# EAGLE design BRMDOOR_control_board (EAGLE 7.2.0)
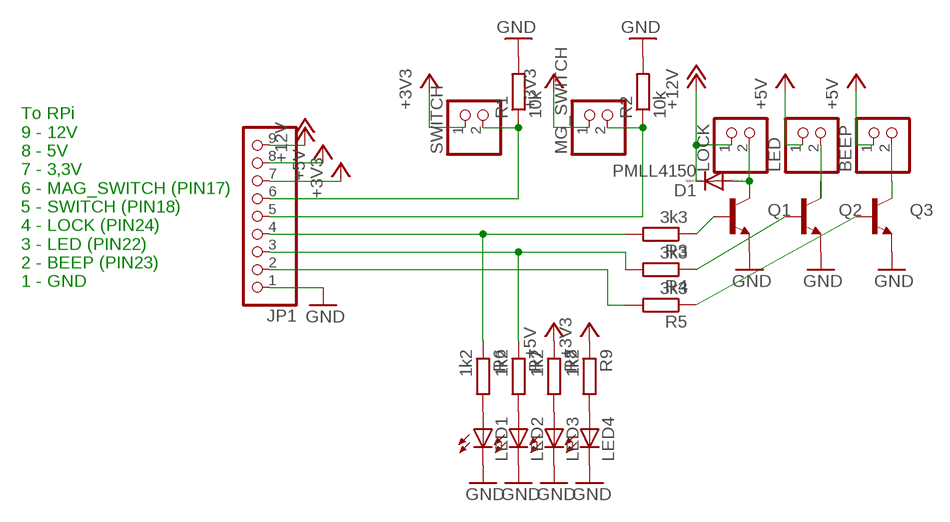
[diagram p0: schematic, sheet 1]

## Parts
BEEP  PINHD-1X2  [1X02]
D1  PMLL4150  [SOD80C]
JP1  PINHD-1X9  [1X09]
LED  PINHD-1X2  [1X02]
LED1  LEDKA-3528ASYC  [KA-3528ASYC]
LED2  LEDKA-3528ASYC  [KA-3528ASYC]
LED3  LEDKA-3528ASYC  [KA-3528ASYC]
LED4  LEDKA-3528ASYC  [KA-3528ASYC]
LOCK  PINHD-1X2  [1X02]
MG_SWITCH  PINHD-1X2  [1X02]
Q1  TRANSISTOR_NPNSMD2  [SOT223]
Q2  TRANSISTOR_NPNSMD2  [SOT223]
Q3  TRANSISTOR_NPNSMD2  [SOT223]
R1  10k  R-EU_M1206  [M1206]
R2  10k  R-EU_M1206  [M1206]
R3  3k3  R-EU_M1206  [M1206]
R4  3k3  R-EU_M1206  [M1206]
R5  3k3  R-EU_M1206  [M1206]
R6  1k2  R-EU_M1206  [M1206]
R7  1k2  R-EU_M1206  [M1206]
R8  1k2  R-EU_M1206  [M1206]
R9  1k2  R-EU_M1206  [M1206]
SWITCH  PINHD-1X2  [1X02]

## Nets
+3V3: JP1.7 MG_SWITCH.1 R9.1 SWITCH.1
+5V: BEEP.1 JP1.8 LED.1 R8.1
+12V: D1.C JP1.9 LOCK.1
GND: JP1.1 LED1.C LED2.C LED3.C LED4.C Q1.3(E) Q2.3(E) Q3.3(E) R1.2 R2.2
N$1: JP1.6 R1.1 SWITCH.2
N$2: JP1.5 MG_SWITCH.2 R2.1
N$3: Q1.1(B) R3.1
N$4: Q2.1(B) R4.1
N$5: Q3.1(B) R5.1
N$6: JP1.4 R3.2 R6.1
N$7: JP1.3 R4.2 R7.1
N$8: JP1.2 R5.2
N$9: LED1.A R6.2
N$10: LED2.A R7.2
N$11: LED3.A R8.2
N$12: LED4.A R9.2
N$13: D1.A LOCK.2 Q1.2(C)
N$14: LED.2 Q2.2(C)
N$15: BEEP.2 Q3.2(C)

## Notes on the sheet
- To RPi
  9 - 12V 
  8 - 5V
  7 - 3,3V
  6 - MAG_SWITCH (PIN17)
  5 - SWITCH (PIN18)
  4 - LOCK (PIN24)
  3 - LED (PIN22)
  2 - BEEP (PIN23)
  1 - GND

## Library data of the parts
BEEP LED LOCK MG_SWITCH SWITCH = pinhead:PINHD-1X2: PIN HEADER
D1 = diode:PMLL4150: DIODE high speed
JP1 = pinhead:PINHD-1X9: PIN HEADER
LED1-LED4 = led:LED: LED OSRAM: - CHIPLED LG R971, LG N971, LY N971, LG Q971, LY Q971, LO R971, LY R971 LH N974, LH R974 LS Q976, LO Q976, LY Q976 LO Q996 - Hyper CHIPLED LW Q18S LB Q993, LB Q99A, LB R99A - SideLED LS A670, LO A670, LY A670, LG A670, LP A670 LB A673, LV A673, LT A673, LW A673 LH A674 LY A675 LS A676, LA A676, LO A676, LY A676, LW A676 LS A679, LY A679, LG A679 - Hyper Micro SIDELED® LS Y876, LA Y876, LO Y876, LY Y876 LT Y87S - SmartLED LW L88C, LW L88S LB L89C, LB L89S, LG L890 LS L89K, LO L89K, LY L89K LS L896, LA L896, LO L896, LY L896 - TOPLED LS T670, LO T670, LY T670, LG T670, LP T670 LSG T670, LSP T670, LSY T670, LOP T670, LYG T670 LG T671, LOG T671, LSG T671 LB T673, LV T673, LT T673, LW T673 LH T674 LS T676, LA T676, LO T676, LY T676, LB T676, LH T676, LSB T676, LW T676 LB T67C, LV T67C, LT T67C, LS T67K, LO T67K, LY T67K, LW E67C LS E67B, LA E67B, LO E67B, LY E67B, LB E67C, LV E67C, LT E67C LW T67C LS T679, LY T679, LG T679 LS T770, LO T770, LY T770, LG T770, LP T770 LB T773, LV T773, LT T773, LW T773 LH T774 LS E675, LA E675, LY E675, LS T675 LS T776, LA T776, LO T776, LY T776, LB T776 LHGB T686 LT T68C, LB T68C - Hyper Mini TOPLED® LB M676 - Mini TOPLED Santana® LG M470 LS M47K, LO M47K, LY M47K Source: http://www.osram.convergy.de LUXEON: - LUMILED® LXK2-PW12-R00, LXK2-PW12-S00, LXK2-PW14-U00, LXK2-PW14-V00 LXK2-PM12-R00, LXK2-PM12-S00, LXK2-PM14-U00 LXK2-PE12-Q00, LXK2-PE12-R00, LXK2-PE12-S00, LXK2-PE14-T00, LXK2-PE14-U00 LXK2-PB12-K00, LXK2-PB12-L00, LXK2-PB12-M00, LXK2-PB14-N00, LXK2-PB14-P00, LXK2-PB14-Q00 LXK2-PR12-L00, LXK2-PR12-M00, LXK2-PR14-Q00, LXK2-PR14-R00 LXK2-PD12-Q00, LXK2-PD12-R00, LXK2-PD12-S00 LXK2-PH12-R00, LXK2-PH12-S00 LXK2-PL12-P00, LXK2-PL12-Q00, LXK2-PL12-R00 Source: www.luxeon.com KINGBRIGHT: KA-3528ASYC Source: www.kingbright.com
Q1-Q3 = SparkFun-DiscreteSemi:TRANSISTOR_NPN: Generic NPN BJT MMBT2222A - TRANS-08049 (SOT-23, 1A 40V) MPSA42 - TRANS-09116 (SOT-23, 500mA 300V) MMBT5088LT1G - TRANS-11160 (SOT-23, 50 mA 30V) BC547 - COM-08928 <http://www.sparkfun.com/products/8928> (TO-92 45V 100mA) (1.Collector 2.Base 3.Emitter) 2N3904 - COM-00521 <http://www.sparkfun.com/products/521> (TO-92 40V 200mA) (1.Emitter 2.Base 3.Collector) P2N2222A - COM-12852 <http://www.sparkfun.com/products/12852> (TO-92 40V 600mA) (1.Collector 2.Base 3.Emitter)
R1-R9 = rcl:R-EU_: RESISTOR, European symbol

## Board
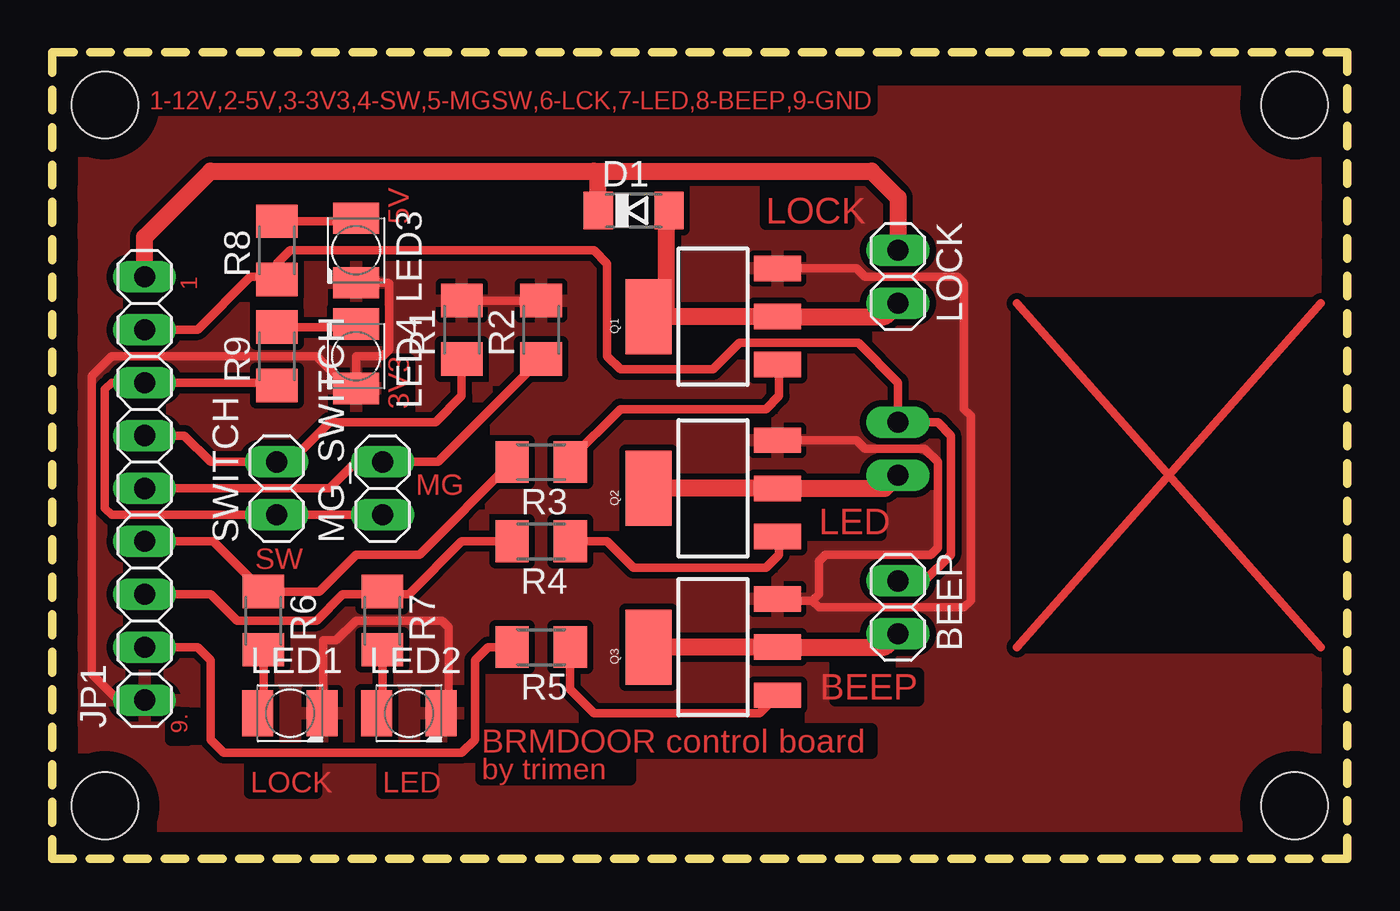
[diagram p1: board, top side]
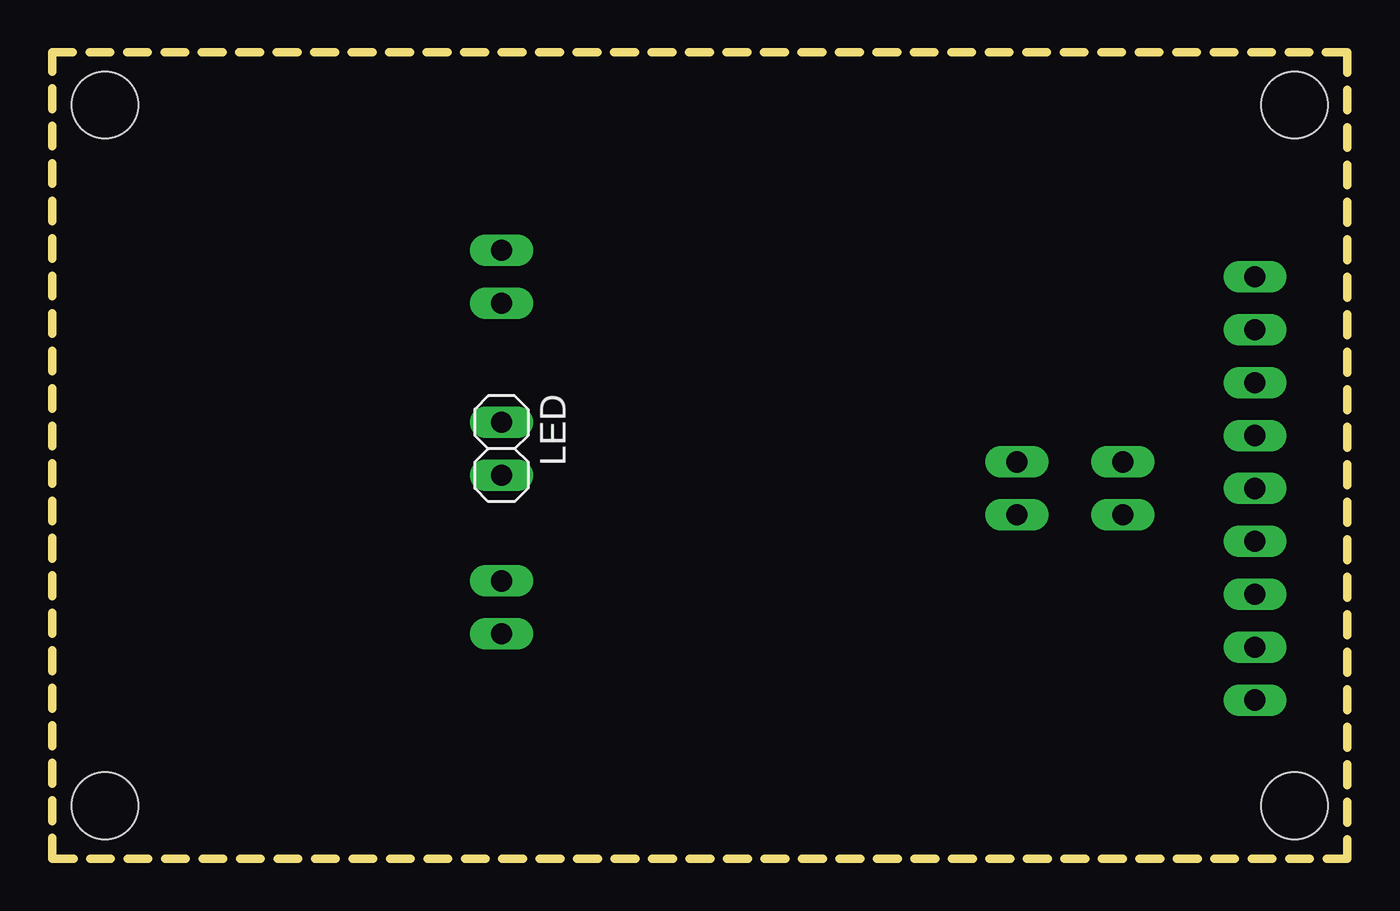
[diagram p2: board, bottom side, seen from below]

Size 62.23 x 38.73 mm. Coordinates in mm from the lower left corner, seen from the top.
Outline: 0,38.73 0,0 62.23,0 62.23,38.73 0,38.73
Copper layers (1*16): Top 0.035mm / dielectric 1.5mm / Bottom 0.035mm
Design rules "default": minimum track width 10mil, minimum drill 24mil, track to track 8mil, track to pad 8mil, pad to pad 8mil, via to via 8mil, smd to smd 8mil, copper to edge 40mil, drill to drill 8mil, minimum pad ring 10mil, minimum via ring 8mil, stop-mask expansion 4mil, vias tented up to drill 0mil, thermal gap 10mil
Holes 3.2 mm at 2.54,36.2 59.69,36.2 59.69,2.54 2.54,2.54
tRestrict: area 46.4,10.2 to 61,26.7

### Footprints (pad centres in the part's own frame; a part is rotated, then mirrored left to right if it is on the bottom)
1X02 = drill 1.016 long: 1 -1.27,0; 2 1.27,0
SOD80C = smd 1.4 x 1.8: A 1.7,0; C -1.7,0
1X09 = drill 1.016 long: 1 -10.16,0; 2 -7.62,0; 3 -5.08,0; 4 -2.54,0; 5 0,0; 6 2.54,0; 7 5.08,0; 8 7.62,0; 9 10.16,0
KA-3528ASYC = smd 1.5 x 2.2: A -1.55,0; C 1.55,0
SOT223 = smd 1.219 x 2.235: 1 -2.311,-3.099; 2 0,-3.099; 3 2.311,-3.099 | smd 3.6 x 2.2: 4 0,3.099
M1206 = smd 1.6 x 2: 1 -1.4,0; 2 1.4,0

### Placement (x,y rotation side)
BEEP  40.64,12.07 270 top
D1  27.94,31.11 0 top
JP1  4.45,17.78 90 top
LED  40.64,19.68 270 bottom
LED1  11.43,6.98 0 top
LED2  17.14,6.98 0 top
LED3  14.61,29.21 270 top
LED4  14.61,24.13 270 top
LOCK  40.64,27.94 270 top
MG_SWITCH  15.88,17.78 90 top
Q1  31.75,26.04 90 top
Q2  31.75,17.78 90 top
Q3  31.75,10.16 90 top
R1  19.68,25.4 90 top
R2  23.5,25.4 90 top
R3  23.5,19.05 180 top
R4  23.5,15.24 180 top
R5  23.5,10.16 180 top
R6  10.16,11.43 270 top
R7  15.88,11.43 270 top
R8  10.79,29.21 90 top
R9  10.79,24.13 90 top
SWITCH  10.79,17.78 90 top

### Tracks (layer width: path | path; a pad name or v marks a point on that pad's centre or on a via)
+3V3
  Top 0.406: R9.1 10.66,22.86 JP1.7 2.86,22.86 2.54,22.54 2.54,16.83 2.86,16.51 SWITCH.1 MG_SWITCH.1
+5V
  Top 0.406: JP1.8 6.98,25.4 9.53,27.94 10.66,27.94 R8.1 10.79,28.57 11.43,29.21 26.04,29.21 26.67,28.57 26.67,24.13 27.3,23.5 31.75,23.5 33.02,24.76 38.73,24.76 40.64,22.86 LED.1 42.55,20.96 43.18,20.32 43.18,14.61 41.91,13.33 BEEP.1
+12V
  Top 0.813: JP1.9 4.45,29.84 7.62,33.02 26.04,33.02 | 26.04,33.02 39.37,33.02 40.64,31.75 LOCK.1 | D1.C 26.24,32.81 26.04,33.02
GND
  Top 0.406: R2.2 R1.2 | 5.08,7.62 JP1.1 3.17,7.62 1.9,8.89 1.9,23.18 2.86,24.13 12.7,24.13 14.25,22.58 LED4.C 14.61,24.13 15.88,24.13 16.19,24.45 16.19,27.62 16.16,27.66 LED3.C | Q1.3 38.65,28.35 39.05,27.94 43.5,27.94 43.81,27.62 43.81,21.59 44.13,21.27 44.13,12.38 43.81,12.07 36.83,12.07 36.51,12.38 | 36.51,12.38 34.94,12.38 Q3.3 | Q2.3 38.65,20.09 39.05,19.68 41.91,19.68 42.55,19.05 42.55,14.92 42.23,14.61 37.15,14.61 36.83,14.29 36.83,12.7 36.51,12.38 | LED1.C 13.02,6.98 13.02,10.48 13.65,10.48 14.61,11.43 18.73,11.43 19.05,11.11 19.05,7.34 LED2.C
  pour Top (isolate 0.305): 0.63,36.83 61.91,36.83 61.91,1.59 0.63,1.59
N$1
  Top 0.406: R1.1 19.68,22.22 18.41,20.96 13.34,20.96 11.43,19.05 SWITCH.2 7.62,19.05 6.35,20.32 JP1.6
N$2
  Top 0.406: JP1.5 13.34,17.78 14.61,19.05 MG_SWITCH.2 18.54,19.05 R2.1
N$3
  Top 0.406: R3.1 24.89,19.18 27.3,21.59 34.29,21.59 34.92,22.22 34.92,23.65 Q1.1
N$4
  Top 0.406: R4.1 26.67,15.24 27.94,13.97 34.29,13.97 34.92,14.61 34.92,15.39 Q2.1
N$5
  Top 0.406: R5.1 24.89,8.12 26.04,6.98 33.98,6.98 Q3.1
N$6
  Top 0.406: JP1.4 7.75,15.24 R6.1 12.83,12.83 14.61,14.61 17.65,14.61 R3.2
N$7
  Top 0.406: JP1.3 7.62,12.7 8.89,11.43 12.7,11.43 13.97,12.7 15.75,12.7 R7.1 16,12.7 17.14,12.7 19.68,15.24 R4.2
N$8
  Top 0.406: JP1.2 6.98,10.16 7.62,9.53 7.62,5.71 8.25,5.08 19.68,5.08 20.32,5.71 20.32,9.53 20.95,10.16 R5.2
N$9
  Top 0.406: R6.2 10.16,7.26 LED1.A
N$10
  Top 0.406: R7.2 15.88,7.26 LED2.A
N$11
  Top 0.406: R8.2 14.45,30.61 LED3.A
N$12
  Top 0.406: R9.2 14.45,25.53 LED4.A
N$13
  Top 0.813: LOCK.2 40.01,26.04 Q1.2 29.53,26.04 29.53,31 D1.A
N$14
  Top 0.813: Q2.2 40.01,17.78 LED.2
N$15
  Top 0.813: Q3.2 40.01,10.16 BEEP.2
N$16
  Top 0.813: 34.29,17.78 28.89,17.78
N$17
  Top 0.813: 33.97,10.16 28.58,10.16
N$18
  Top 0.406: 60.96,10.16 46.35,26.67
N$19
  Top 0.406: 46.35,10.16 60.96,26.67

### Text on the board
Top: 1-12V,2-5V,3-3V3,4-SW,5-MGSW,6-LCK,7-LED,8-BEEP,9-GND | 5V | LOCK | 1 | 3V3 | MG | SW | LED | BEEP | 9. | BRMDOOR control board | by trimen | LOCK | LED
201bmp: /tmp/mole_01.bmp